# EAGLE design Etage1_ok (EAGLE 9.0.0)
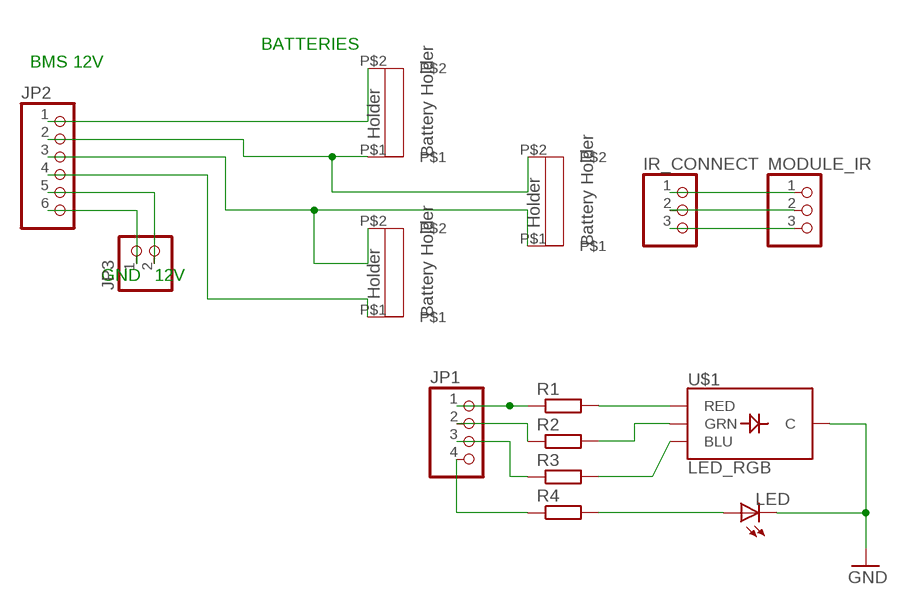
[diagram p0: schematic, sheet 1]

## Parts
IR_CONNECT  PINHD-1X3/LONG  [1X03]
JP1  PINHD-1X4/LONG  [1X04]
JP2  PINHD-1X6/LONG  [1X06]
JP3  PINHD-1X2/LONG  [1X02]
LED  LED5MM  [LED5MM]
MODULE_IR  PINHD-1X3/LONG  [1X03]
R1  R-EU_0207/10  [0207/10]
R2  R-EU_0207/10  [0207/10]
R3  R-EU_0207/10  [0207/10]
R4  R-EU_0207/10  [0207/10]
U$1  LED_RGB  [LED-RGB-THRU]
U$2  SUPPORT_BATTERY  [BATTERY_HOLDER]
U$3  SUPPORT_BATTERY  [BATTERY_HOLDER]
U$4  SUPPORT_BATTERY  [BATTERY_HOLDER]

## Nets
GND: LED.K(C) U$1.2(C)
N$1: JP2.1 U$4.P$2
N$2: IR_CONNECT.1 MODULE_IR.1
N$3: JP2.3 U$2.P$1 U$3.P$2
N$4: JP2.5 JP3.2
N$5: JP2.4 U$3.P$1
N$6: JP2.6 JP3.1
N$7: R1.2 U$1.4(RED)
N$8: R2.2 U$1.3(GRN)
N$9: IR_CONNECT.2 MODULE_IR.2
N$10: JP1.1 R1.1
N$11: R3.2 U$1.1(BLU)
N$12: LED.A R4.2
N$13: JP1.4 R4.1
N$14: JP1.2 R2.1
N$15: IR_CONNECT.3 MODULE_IR.3
N$16: JP1.3 R3.1
N$17: JP2.2 U$2.P$2 U$4.P$1

## Notes on the sheet
- BATTERIES
- BMS 12V
- GND | 12V

## Library data of the parts
IR_CONNECT MODULE_IR = pinhead_v2:PINHD-1X3: PIN HEADER
JP1 = pinhead_v2:PINHD-1X4: PIN HEADER
JP2 = pinhead_v2:PINHD-1X6: PIN HEADER
JP3 = pinhead_v2:PINHD-1X2: PIN HEADER
LED = led:LED: LED OSRAM: - CHIPLED LG R971, LG N971, LY N971, LG Q971, LY Q971, LO R971, LY R971 LH N974, LH R974 LS Q976, LO Q976, LY Q976 LO Q996 - Hyper CHIPLED LW Q18S LB Q993, LB Q99A, LB R99A - SideLED LS A670, LO A670, LY A670, LG A670, LP A670 LB A673, LV A673, LT A673, LW A673 LH A674 LY A675 LS A676, LA A676, LO A676, LY A676, LW A676 LS A679, LY A679, LG A679 - Hyper Micro SIDELED® LS Y876, LA Y876, LO Y876, LY Y876 LT Y87S - SmartLED LW L88C, LW L88S LB L89C, LB L89S, LG L890 LS L89K, LO L89K, LY L89K LS L896, LA L896, LO L896, LY L896 - TOPLED LS T670, LO T670, LY T670, LG T670, LP T670 LSG T670, LSP T670, LSY T670, LOP T670, LYG T670 LG T671, LOG T671, LSG T671 LB T673, LV T673, LT T673, LW T673 LH T674 LS T676, LA T676, LO T676, LY T676, LB T676, LH T676, LSB T676, LW T676 LB T67C, LV T67C, LT T67C, LS T67K, LO T67K, LY T67K, LW E67C LS E67B, LA E67B, LO E67B, LY E67B, LB E67C, LV E67C, LT E67C LW T67C LS T679, LY T679, LG T679 LS T770, LO T770, LY T770, LG T770, LP T770 LB T773, LV T773, LT T773, LW T773 LH T774 LS E675, LA E675, LY E675, LS T675 LS T776, LA T776, LO T776, LY T776, LB T776 LHGB T686 LT T68C, LB T68C - Hyper Mini TOPLED® LB M676 - Mini TOPLED Santana® LG M470 LS M47K, LO M47K, LY M47K Source: http://www.osram.convergy.de LUXEON: - LUMILED® LXK2-PW12-R00, LXK2-PW12-S00, LXK2-PW14-U00, LXK2-PW14-V00 LXK2-PM12-R00, LXK2-PM12-S00, LXK2-PM14-U00 LXK2-PE12-Q00, LXK2-PE12-R00, LXK2-PE12-S00, LXK2-PE14-T00, LXK2-PE14-U00 LXK2-PB12-K00, LXK2-PB12-L00, LXK2-PB12-M00, LXK2-PB14-N00, LXK2-PB14-P00, LXK2-PB14-Q00 LXK2-PR12-L00, LXK2-PR12-M00, LXK2-PR14-Q00, LXK2-PR14-R00 LXK2-PD12-Q00, LXK2-PD12-R00, LXK2-PD12-S00 LXK2-PH12-R00, LXK2-PH12-S00 LXK2-PL12-P00, LXK2-PL12-Q00, LXK2-PL12-R00 Source: www.luxeon.com KINGBRIGHT: KA-3528ASYC Source: www.kingbright.com
R1-R4 = rcl:R-EU_: RESISTOR, European symbol; SPICEPREFIX: R
U$1 = LED_RGB:LED_RGB
U$2-U$4 = Battery Holder:SUPPORT_BATTERY

## Board
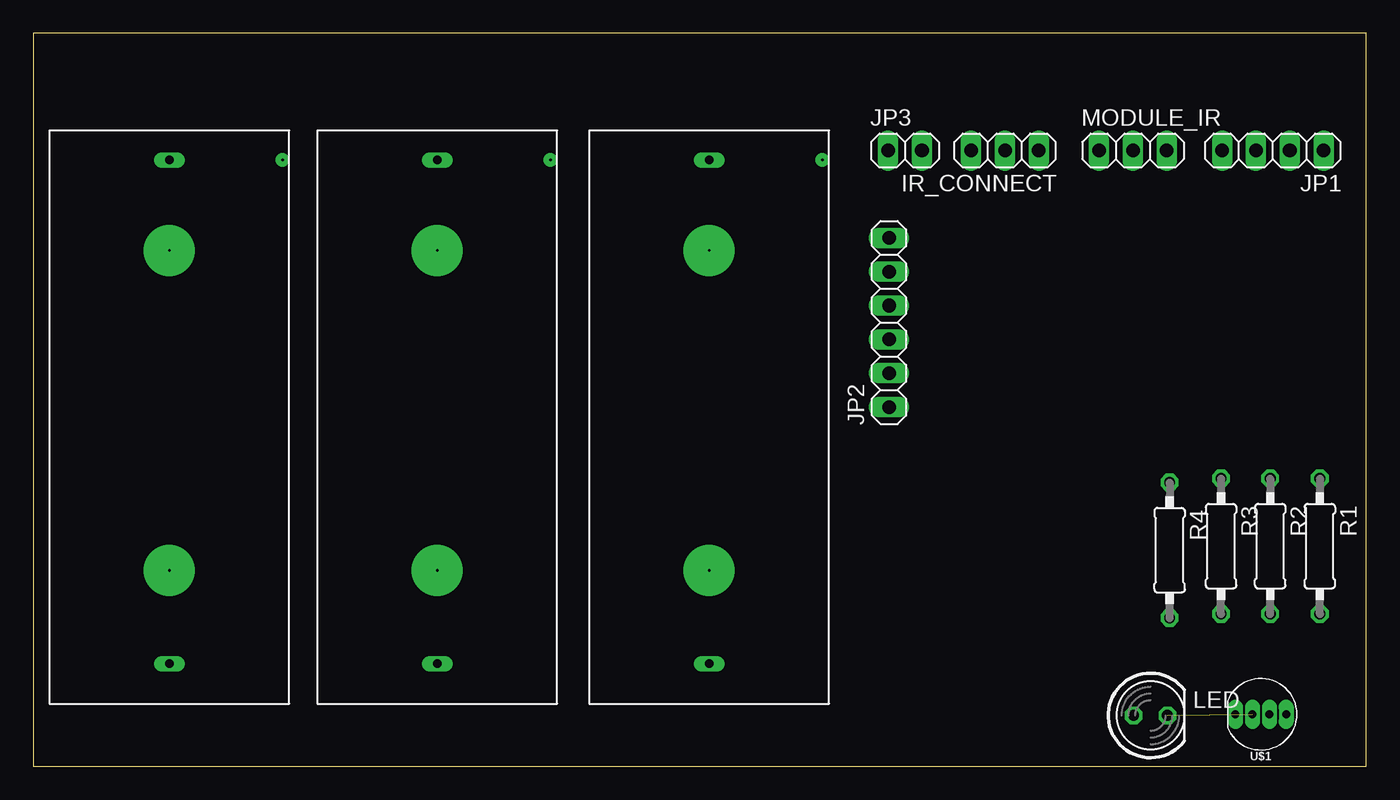
[diagram p1: board, top side]
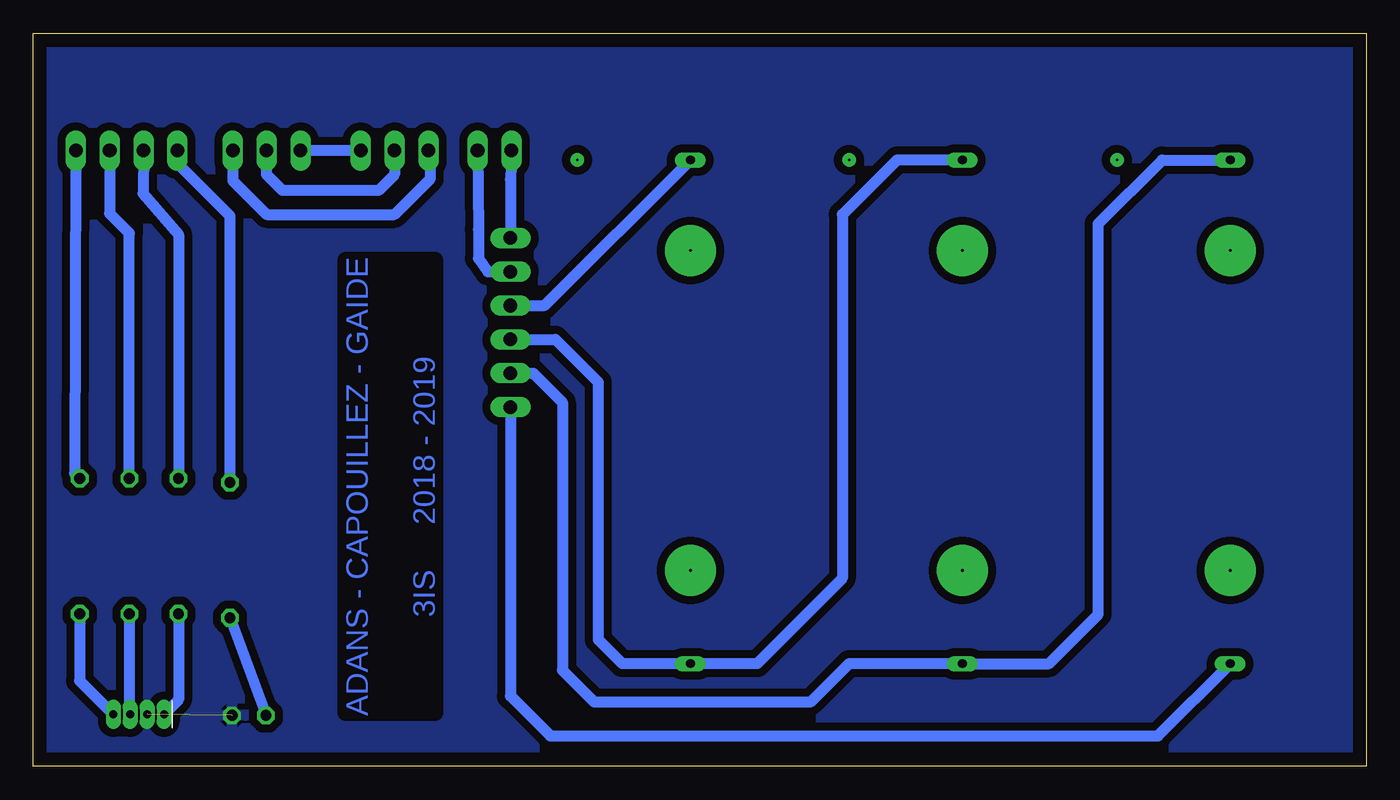
[diagram p2: board, bottom side, seen from below]

Size 100 x 55 mm. Coordinates in mm from the lower left corner, seen from the top.
Outline: 0,0 100,0 100,55 0,55 0,0
Copper layers (1*16): Top 0.035mm / dielectric 1.5mm / Bottom 0.035mm
Design rules "default": minimum track width 6mil, minimum drill 0.35mm, track to track 6mil, track to pad 6mil, pad to pad 6mil, via to via 6mil, smd to smd 6mil, copper to edge 40mil, drill to drill 6mil, minimum pad ring 10mil, minimum via ring 8mil, stop-mask expansion 4mil, vias tented up to drill 0mil, thermal gap 10mil

### Footprints (pad centres in the part's own frame; a part is rotated, then mirrored left to right if it is on the bottom)
1X03 = drill 1.016 long: 1 -2.54,0; 2 0,0; 3 2.54,0
1X04 = drill 1.016 long: 1 -3.81,0; 2 -1.27,0; 3 1.27,0; 4 3.81,0
1X06 = drill 1.016 long: 1 -6.35,0; 2 -3.81,0; 3 -1.27,0; 4 1.27,0; 5 3.81,0; 6 6.35,0
1X02 = drill 1.016 long: 1 -1.27,0; 2 1.27,0
LED5MM = drill 0.813 octagon: A -1.27,0; K 1.27,0
0207/10 = drill 0.813 octagon: 1 -5.08,0; 2 5.08,0
LED-RGB-THRU = drill 0.6 pad 0.711 long: 1 1.905,0; 2 0.635,0; 3 -0.635,0; 4 -1.905,0
BATTERY_HOLDER = drill 0.65 long: P$1 2.2,9; P$2 40,9 | drill 0.2 pad 3.81: P$3 9,9; P$4 33,9 | drill 0.2 pad 1.016: P$5 2.2,17.5

### Placement (x,y rotation side)
IR_CONNECT  72.9,46.2 180 top
JP1  93,46.2 180 top
JP2  64.2,33.3 90 top
JP3  65.4,46.2 0 top
LED  83.82,3.81 0 top
MODULE_IR  82.5,46.2 0 top
R1  96.52,16.51 270 top
R2  92.8,16.51 270 top
R3  89.11,16.51 270 top
R4  85.25,16.21 270 top
U$1  92.1,3.9 180 top
U$2  21.3,47.7 270 top
U$3  41.7,47.7 270 top
U$4  1.2,47.7 270 top

### Tracks (layer width: path | path; a pad name or v marks a point on that pad's centre or on a via)
GND  (1 unrouted)
  pour Bottom (isolate 0.61): 101.2,56.4 101.7,-1.5 -1.2,-1.5 -1.7,56.4
N$1
  Bottom 0.813: U$4.P$2 15.63,2.27 61.2,2.27 64.2,5.27 JP2.1
N$2
  Bottom 0.813: IR_CONNECT.1 MODULE_IR.1
N$3
  Bottom 0.813: U$2.P$1 35.2,45.5 39.3,41.4 39.3,14.1 45.7,7.7 U$3.P$2 55.8,7.7 57.6,9.5 57.6,28.8 60.83,32.03 JP2.3
N$4
  Bottom 0.813: JP3.2 66.6,40.27 66.6,38.1 65.91,37.11 JP2.5
N$5
  Bottom 0.813: JP2.4 61.63,34.57 U$3.P$1
N$6
  Bottom 0.813: JP3.1 64.2,44.03 JP2.6
N$7
  Bottom 0.813: R1.2 96.52,6.42 U$1.4
N$8
  Bottom 0.813: R2.2 92.8,3.96 U$1.3
N$9
  Bottom 0.813: IR_CONNECT.2 72.9,44.4 74.1,43.2 81.3,43.2 82.5,44.4 MODULE_IR.2
N$10
  Bottom 0.813: JP1.1 96.9,21.97 R1.1
N$11
  Bottom 0.813: R3.2 89.11,4.99 U$1.1
N$12
  Bottom 0.813: R4.2 LED.A
N$13
  Bottom 0.813: R4.1 85.25,41.3 89.19,45.24 JP1.4
N$14
  Bottom 0.813: R2.1 92.8,40 94.27,41.47 JP1.2
N$15
  Bottom 0.813: MODULE_IR.3 85.04,43.94 82.5,41.4 72.9,41.4 70.2,44.1 70.2,46.04 IR_CONNECT.3
N$16
  Bottom 0.813: R3.1 89.1,39.9 91.77,42.97 JP1.3
N$17
  Bottom 0.813: U$4.P$1 15.3,45.5 20.1,40.7 20.1,11.4 23.8,7.7 U$2.P$2 38.8,7.7 41.7,4.8 57.9,4.8 60.3,7.2 60.3,27.3 62.49,29.49 JP2.2

### Text on the board
Bottom: ADANS - CAPOUILLEZ - GAIDE / / 3IS 2018 - 2019